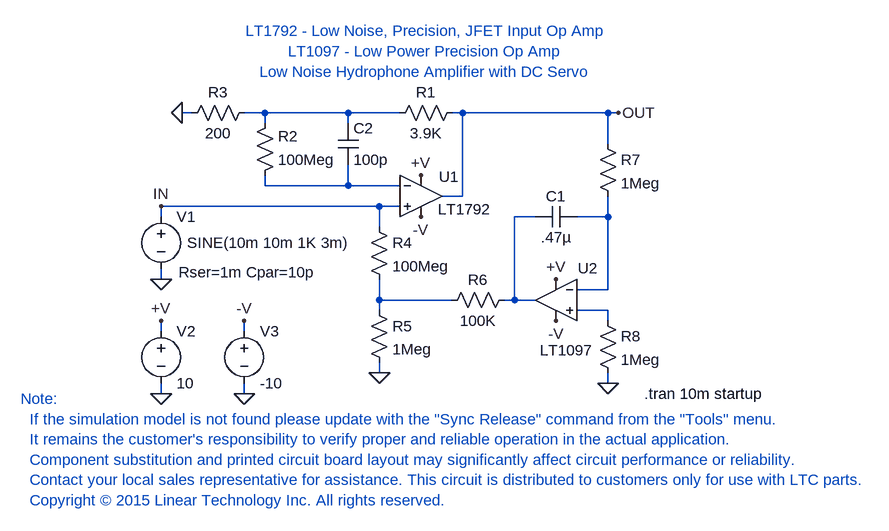
[diagram p0: schematic LT1792_LT1097_TA01.asc]
LT1792_LT1097_TA01.asc, the LTspice schematic file:
Version 4
SHEET 1 1136 680
WIRE -352 0 -368 0
WIRE -240 0 -272 0
WIRE -112 0 -240 0
WIRE -32 0 -112 0
WIRE 64 0 48 0
WIRE 288 0 64 0
WIRE 304 0 288 0
WIRE -240 16 -240 0
WIRE -112 16 -112 0
WIRE 288 48 288 0
WIRE -240 112 -240 96
WIRE -112 112 -112 80
WIRE -112 112 -240 112
WIRE -32 112 -112 112
WIRE 64 128 64 0
WIRE 64 128 32 128
WIRE -64 144 -400 144
WIRE -32 144 -64 144
WIRE -400 160 -400 144
WIRE 176 160 144 160
WIRE 288 160 288 128
WIRE 288 160 240 160
WIRE -64 176 -64 144
WIRE -400 256 -400 240
WIRE 288 272 288 160
WIRE 288 272 240 272
WIRE -64 288 -64 256
WIRE 48 288 -64 288
WIRE 144 288 144 160
WIRE 144 288 128 288
WIRE 176 288 144 288
WIRE -64 304 -64 288
WIRE 288 304 240 304
WIRE 288 320 288 304
WIRE -400 336 -400 320
WIRE -272 336 -272 320
WIRE -64 400 -64 384
WIRE 288 416 288 400
WIRE -400 432 -400 416
WIRE -272 432 -272 416
FLAG -368 0 0
FLAG -64 400 0
FLAG 288 416 0
FLAG 304 0 OUT
FLAG -400 256 0
FLAG -400 144 IN
FLAG -272 432 0
FLAG -400 432 0
FLAG -400 320 +V
FLAG -272 320 -V
FLAG 0 96 +V
FLAG 208 256 +V
FLAG 0 160 -V
FLAG 208 320 -V
SYMBOL LT1792 0 64 R0
WINDOW 0 28 34 Left 2
WINDOW 3 26 84 Left 2
SYMATTR InstName U1
SYMBOL res 64 -16 R90
WINDOW 0 0 56 VBottom 2
WINDOW 3 32 56 VTop 2
SYMATTR InstName R1
SYMATTR Value 3.9K
SYMBOL res -256 112 M180
WINDOW 0 36 76 Left 2
WINDOW 3 36 40 Left 2
SYMATTR InstName R2
SYMATTR Value 100Meg
SYMBOL res -256 -16 R90
WINDOW 0 0 56 VBottom 2
WINDOW 3 32 56 VTop 2
SYMATTR InstName R3
SYMATTR Value 200
SYMBOL res -80 160 R0
SYMATTR InstName R4
SYMATTR Value 100Meg
SYMBOL res -80 288 R0
SYMATTR InstName R5
SYMATTR Value 1Meg
SYMBOL res 144 272 R90
WINDOW 0 0 56 VBottom 2
WINDOW 3 32 56 VTop 2
SYMATTR InstName R6
SYMATTR Value 100K
SYMBOL res 272 32 R0
SYMATTR InstName R7
SYMATTR Value 1Meg
SYMBOL res 272 304 R0
SYMATTR InstName R8
SYMATTR Value 1Meg
SYMBOL cap 240 144 R90
WINDOW 0 0 32 VBottom 2
WINDOW 3 32 32 VTop 2
SYMATTR InstName C1
SYMATTR Value .47µ
SYMBOL voltage -400 144 R0
WINDOW 123 0 0 Left 2
WINDOW 39 27 101 Left 2
WINDOW 3 40 56 Left 2
SYMATTR SpiceLine Rser=1m Cpar=10p
SYMATTR Value SINE(10m 10m 1K 3m)
SYMATTR InstName V1
SYMBOL voltage -400 320 R0
WINDOW 123 0 0 Left 2
WINDOW 39 0 0 Left 2
SYMATTR InstName V2
SYMATTR Value 10
SYMBOL voltage -272 320 R0
WINDOW 123 0 0 Left 2
WINDOW 39 0 0 Left 2
SYMATTR InstName V3
SYMATTR Value -10
SYMBOL cap -128 16 R0
SYMATTR InstName C2
SYMATTR Value 100p
SYMBOL Opamps\\LT1097 208 224 M0
WINDOW 0 -64 15 Left 2
WINDOW 3 -58 141 Left 2
SYMATTR InstName U2
TEXT 344 432 Left 2 !.tran 10m startup
TEXT 8 -48 Bottom 2 ;LT1792 - Low Noise, Precision, JFET Input Op Amp\nLT1097 - Low Power Precision Op Amp\nLow Noise Hydrophone Amplifier with DC Servo
TEXT -616 440 Left 2 ;Note:\n  If the simulation model is not found please update with the "Sync Release" command from the "Tools" menu.\n  It remains the customer's responsibility to verify proper and reliable operation in the actual application.\n  Component substitution and printed circuit board layout may significantly affect circuit performance or reliability.\n  Contact your local sales representative for assistance. This circuit is distributed to customers only for use with LTC parts.\n  Copyright © 2015 Linear Technology Inc. All rights reserved.

The netlist it stands for:
* LT1792_LT1097_TA01.asc
* U1: LT1792 (symbol LT1792 not available, pins judged from their places): In+=IN In-=N002 V+=+V V-=-V OUT=OUT
R1 OUT N001 3.9K
R2 N002 N001 100Meg
R3 N001 0 200
R4 IN N005 100Meg
R5 N005 0 1Meg
R6 N003 N005 100K
R7 OUT N004 1Meg
R8 N006 0 1Meg
C1 N004 N003 .47µ
V1 IN 0 SINE(10m 10m 1K 3m) Rser=1m Cpar=10p
V2 +V 0 10
V3 -V 0 -10
C2 N001 N002 100p
XU2 N006 N004 +V -V N003 LT1097  ; pins In+ In- V+ V- OUT
.tran 10m startup
* LT1792 - Low Noise, Precision, JFET Input Op Amp
* LT1097 - Low Power Precision Op Amp
* Low Noise Hydrophone Amplifier with DC Servo
* Note:
*   If the simulation model is not found please update with the "Sync Release" command from the "Tools" menu.
*   It remains the customer's responsibility to verify proper and reliable operation in the actual application.
*   Component substitution and printed circuit board layout may significantly affect circuit performance or reliability.
*   Contact your local sales representative for assistance. This circuit is distributed to customers only for use with LTC parts.
*   Copyright © 2015 Linear Technology Inc. All rights reserved.
.backanno
.end